# EAGLE design Pop-Up 1.0 (EAGLE 7.2.0)
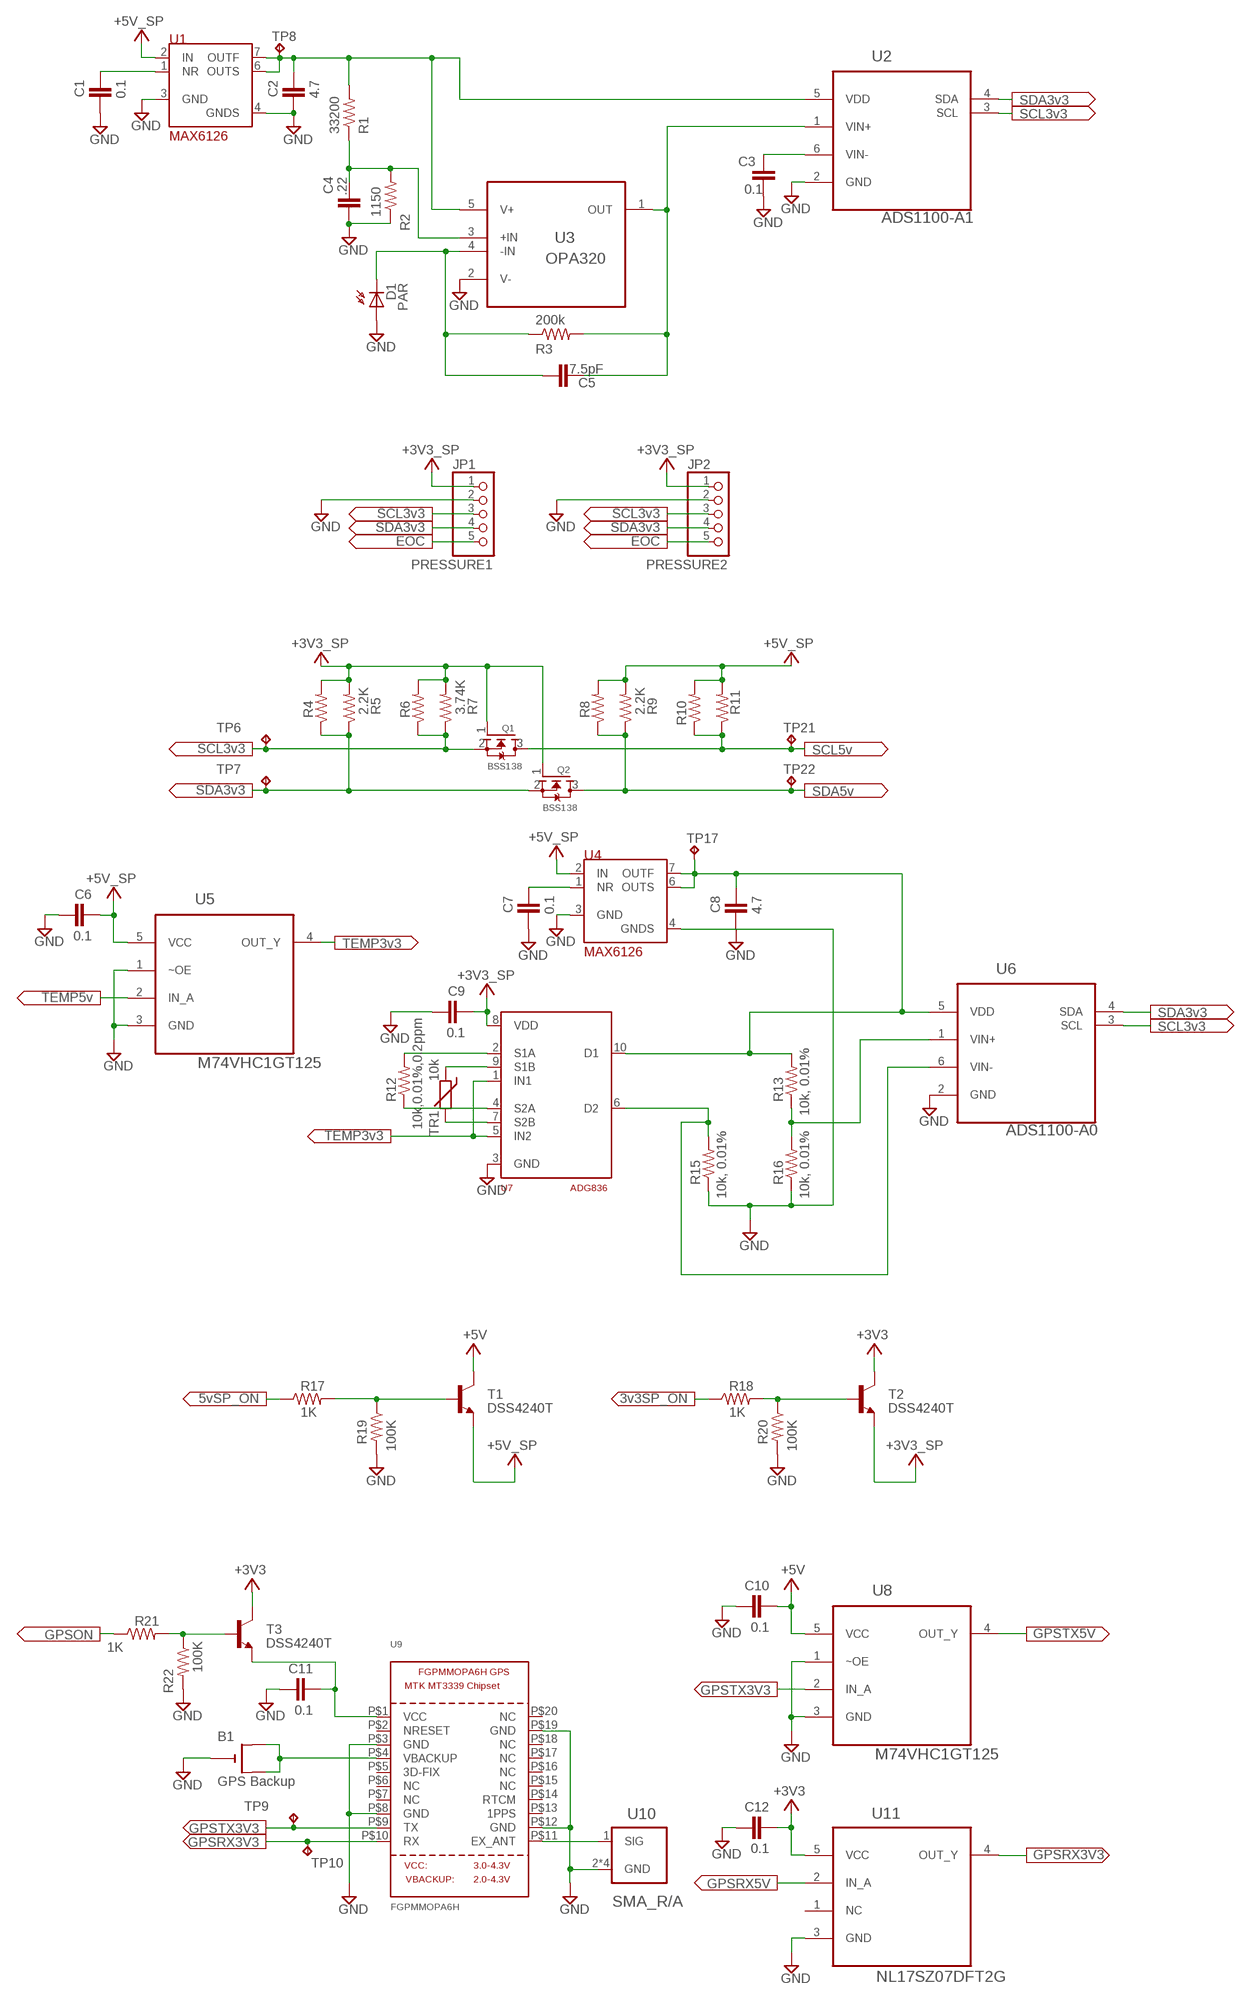
[diagram p0: schematic, sheet 1, part 1 of 2]
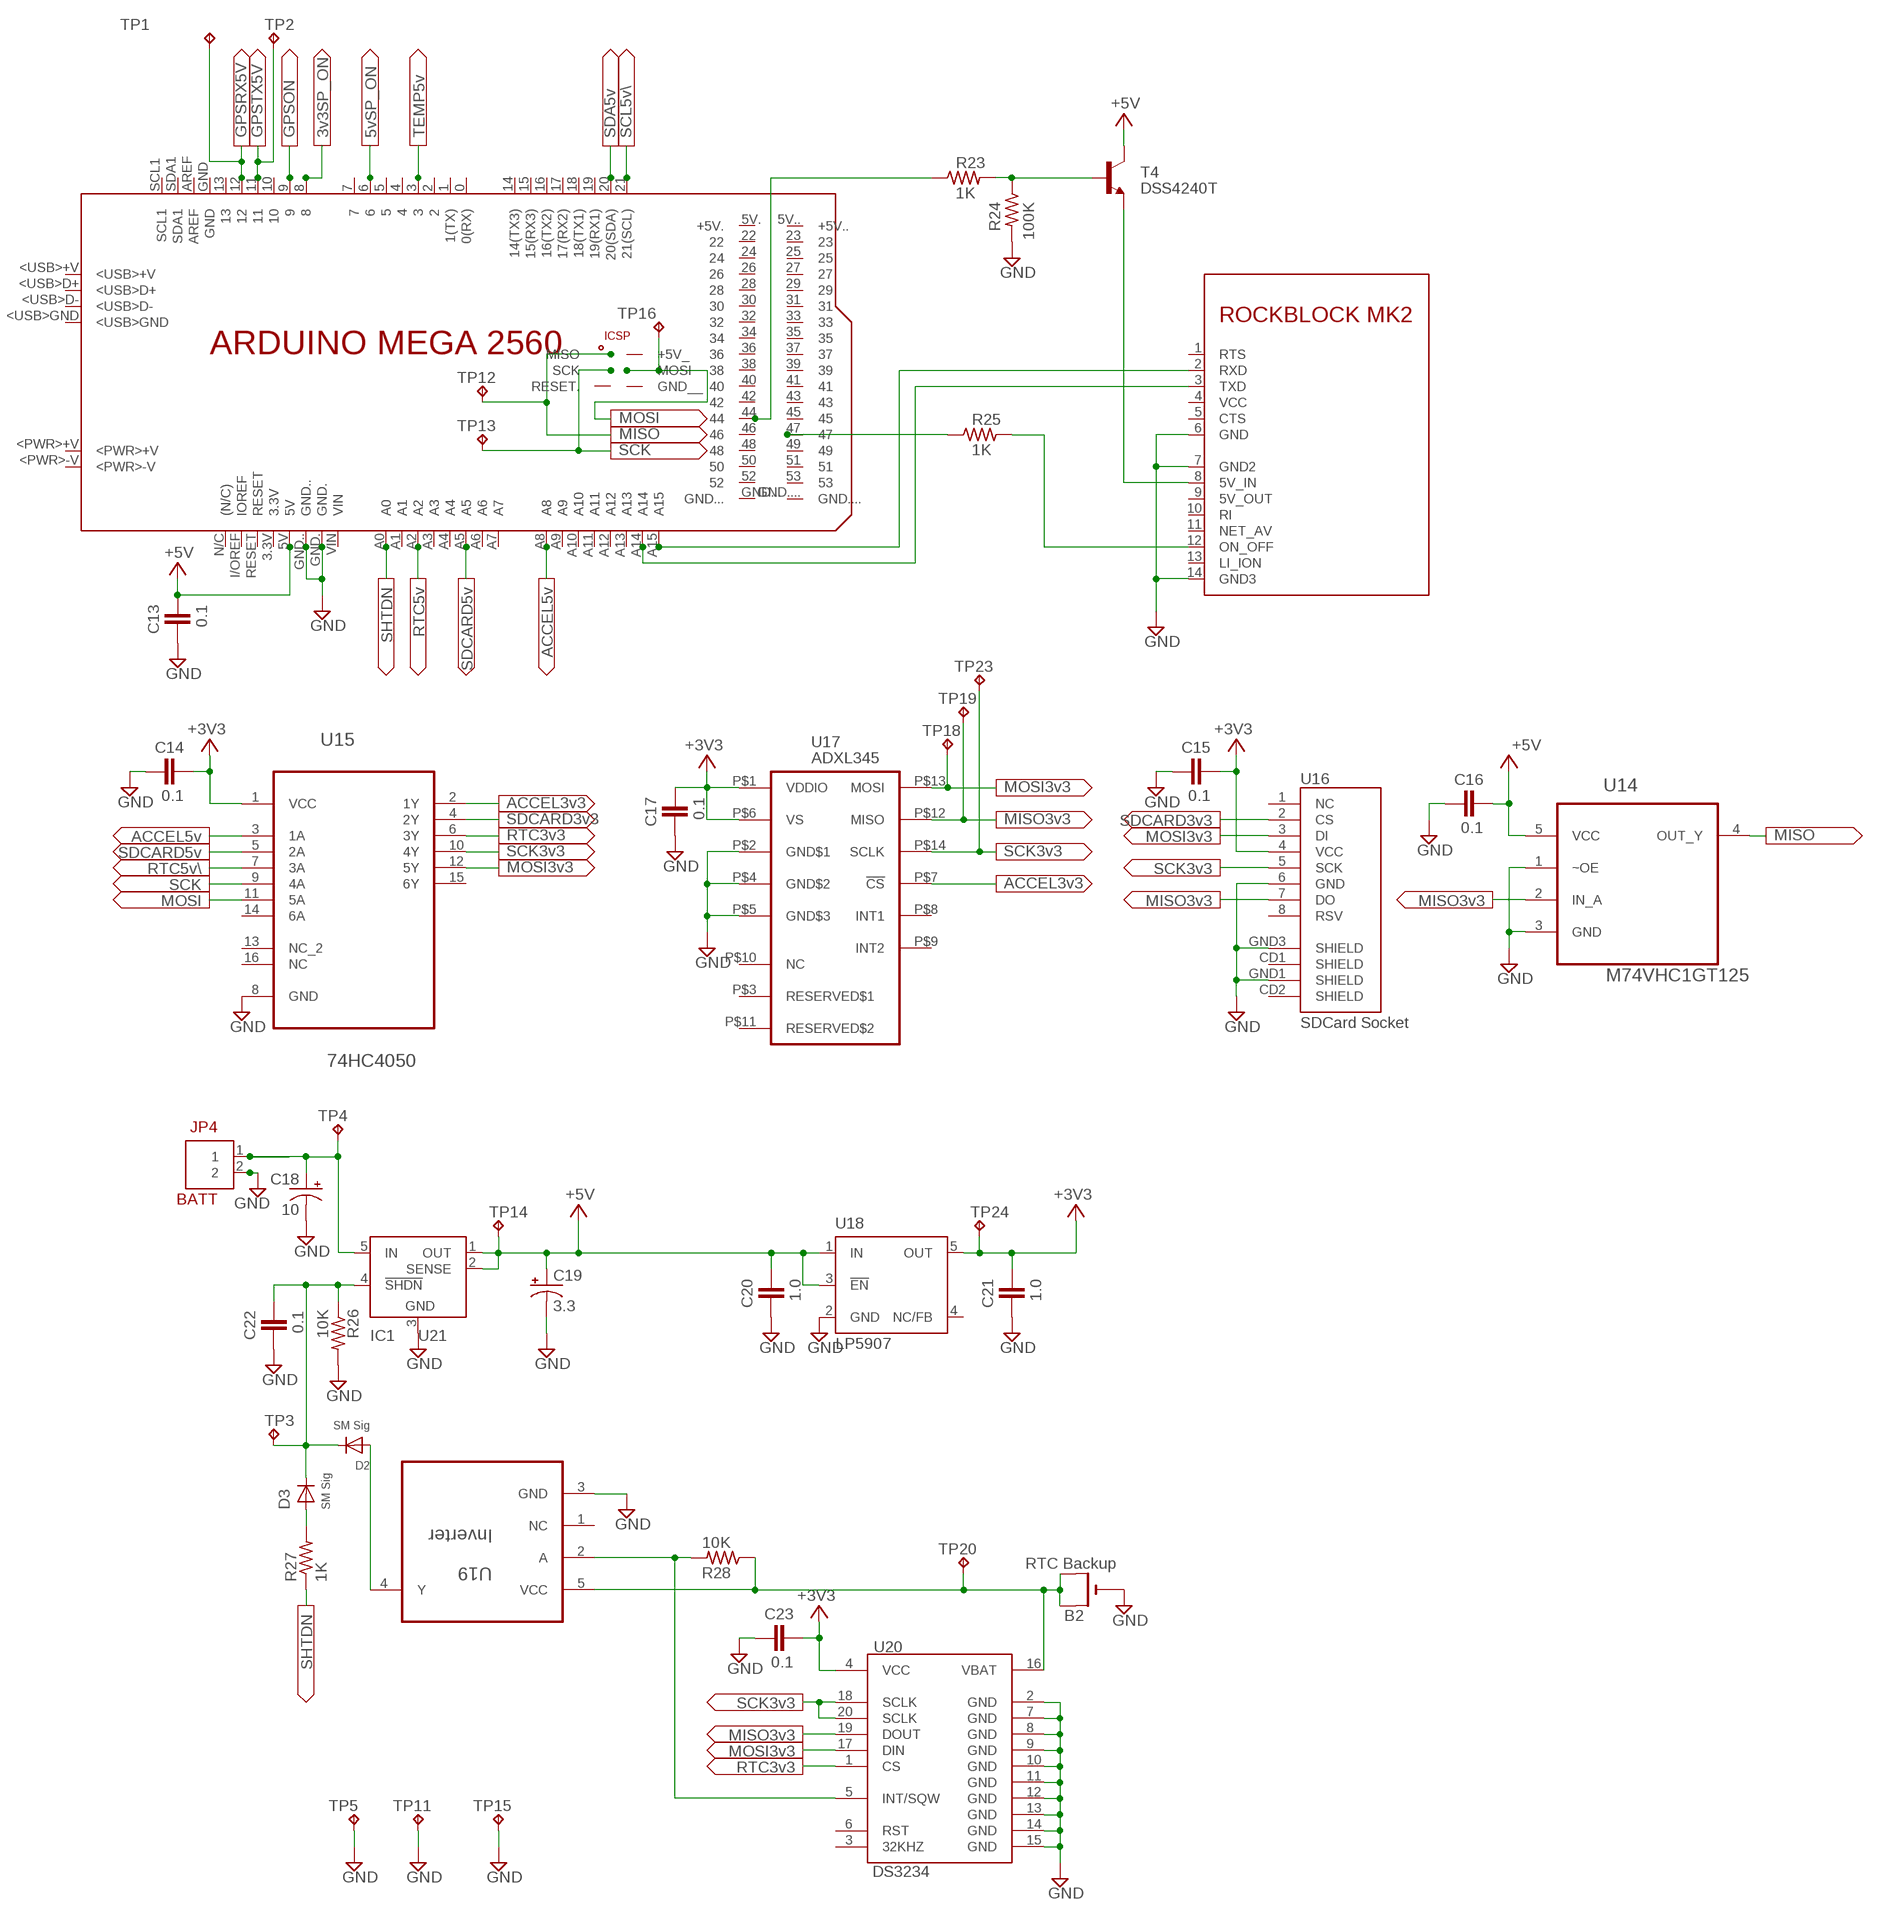
[diagram p1: schematic, sheet 1, part 2 of 2]

## Parts
B1  GPS Backup  CR1220SMT  [CR1220-SMD]
B2  RTC Backup  CR1220SMT  [CR1220-SMD]
C1  0.1  CAP0603-CAP  [0603-CAP]
C2  4.7  CAP0603-CAP  [0603-CAP]
C3  0.1  CAP0603-CAP  [0603-CAP]
C4  .22  CAP0603-CAP  [0603-CAP]
C5  7.5pF  CAP0603-CAP  [0603-CAP]
C6  0.1  CAP0603-CAP  [0603-CAP]
C7  0.1  CAP0603-CAP  [0603-CAP]
C8  4.7  CAP0603-CAP  [0603-CAP]
C9  0.1  CAP0603-CAP  [0603-CAP]
C10  0.1  CAP0603-CAP  [0603-CAP]
C11  0.1  CAP0603-CAP  [0603-CAP]
C12  0.1  CAP0603-CAP  [0603-CAP]
C13  0.1  CAP0603-CAP  [0603-CAP]
C14  0.1  CAP0603-CAP  [0603-CAP]
C15  0.1  CAP0603-CAP  [0603-CAP]
C16  0.1  CAP0603-CAP  [0603-CAP]
C17  0.1  CAP0603-CAP  [0603-CAP]
C18  10  CPOL-USA/3216-18R  [A/3216-18R]
C19  3.3  CPOL-USA/3216-18R  [A/3216-18R]
C20  1.0  CAP0603-CAP  [0603-CAP]
C21  1.0  CAP0603-CAP  [0603-CAP]
C22  0.1  CAP0603-CAP  [0603-CAP]
C23  0.1  CAP0603-CAP  [0603-CAP]
D1  PAR  SFH225  [SFH225]
D2  SM Sig  DIODESOD-323F  [SOD-323F]
D3  SM Sig  DIODESOD-323F  [SOD-323F]
IC1  U21  LT1129CQ-5  [Q5-DD]
JP1  PRESSURE1  PINHD-1X5  [1X05]
JP2  PRESSURE2  PINHD-1X5  [1X05]
JP4  BATT  KK-156-2  [KK-156-2]
Q1  BSS138  MOSFET-NREFLOW  [SOT23]
Q2  BSS138  MOSFET-NREFLOW  [SOT23]
R1  33200  R-US_R0603  [R0603]
R2  1150  R-US_R0603  [R0603]
R3  200k  R-US_R0603  [R0603]
R4  R-US_0204/2V  [0204V]
R5  2.2K  R-US_R0603  [R0603]
R6  R-US_0204/2V  [0204V]
R7  3.74K  R-US_R0603  [R0603]
R8  R-US_0204/2V  [0204V]
R9  2.2K  R-US_R0603  [R0603]
R10  R-US_0204/2V  [0204V]
R11  R-US_R0603  [R0603]
R12  10k,0.01%,0.2ppm  R-US_R1206  [R1206]
R13  10k, 0.01%  R-US_R0603  [R0603]
R15  10k, 0.01%  R-US_R0603  [R0603]
R16  10k, 0.01%  R-US_R0603  [R0603]
R17  1K  R-US_R0603  [R0603]
R18  1K  R-US_R0603  [R0603]
R19  100K  R-US_R0603  [R0603]
R20  100K  R-US_R0603  [R0603]
R21  1K  R-US_R0603  [R0603]
R22  100K  R-US_R0603  [R0603]
R23  1K  R-US_R0603  [R0603]
R24  100K  R-US_R0603  [R0603]
R25  1K  R-US_R0603  [R0603]
R26  10K  R-US_R0603  [R0603]
R27  1K  R-US_R0603  [R0603]
R28  10K  R-US_R0603  [R0603]
SUPPLY1  SDA3v3  V-->  (no package)
SUPPLY3  SCL3v3  V-->  (no package)
SUPPLY12  SCL3v3  V-->  (no package)
SUPPLY14  SCL3v3  V-->  (no package)
SUPPLY15  SDA3v3  V-->  (no package)
SUPPLY16  SDA3v3  V-->  (no package)
SUPPLY17  EOC  V-->  (no package)
SUPPLY18  EOC  V-->  (no package)
SUPPLY19  SCL3v3  V-->  (no package)
SUPPLY20  SCL5v  V-->  (no package)
SUPPLY21  SDA3v3  V-->  (no package)
SUPPLY22  SDA5v  V-->  (no package)
SUPPLY25  TEMP3v3  V-->  (no package)
SUPPLY28  TEMP5v  V-->  (no package)
SUPPLY29  SDA3v3  V-->  (no package)
SUPPLY31  SCL3v3  V-->  (no package)
SUPPLY34  TEMP3v3  V-->  (no package)
SUPPLY37  5vSP_ON  V-->  (no package)
SUPPLY38  3v3SP_ON  V-->  (no package)
SUPPLY42  GPSON  V-->  (no package)
SUPPLY43  GPSTX5V  V-->  (no package)
SUPPLY44  GPSTX3V3  V-->  (no package)
SUPPLY49  GPSTX3V3  V-->  (no package)
SUPPLY50  GPSRX3V3  V-->  (no package)
SUPPLY52  GPSRX3V3  V-->  (no package)
SUPPLY53  GPSRX5V  V-->  (no package)
SUPPLY57  GPSRX5V  V-->  (no package)
SUPPLY58  GPSTX5V  V-->  (no package)
SUPPLY59  GPSON  V-->  (no package)
SUPPLY60  3v3SP_ON  V-->  (no package)
SUPPLY61  5vSP_ON  V-->  (no package)
SUPPLY62  TEMP5v  V-->  (no package)
SUPPLY63  SDA5v  V-->  (no package)
SUPPLY64  SCL5v\  V-->  (no package)
SUPPLY66  MOSI  V-->  (no package)
SUPPLY67  MISO  V-->  (no package)
SUPPLY68  SCK  V-->  (no package)
SUPPLY69  SHTDN  V-->  (no package)
SUPPLY70  RTC5v  V-->  (no package)
SUPPLY71  SDCARD5v  V-->  (no package)
SUPPLY72  ACCEL5v  V-->  (no package)
SUPPLY77  MOSI3v3  V-->  (no package)
SUPPLY79  ACCEL3v3  V-->  (no package)
SUPPLY80  SDCARD3v3  V-->  (no package)
SUPPLY81  MISO3v3  V-->  (no package)
SUPPLY82  SDCARD3v3  V-->  (no package)
SUPPLY83  ACCEL5v  V-->  (no package)
SUPPLY84  RTC3v3  V-->  (no package)
SUPPLY85  MOSI3v3  V-->  (no package)
SUPPLY87  MISO  V-->  (no package)
SUPPLY88  SDCARD5v  V-->  (no package)
SUPPLY89  SCK3v3  V-->  (no package)
SUPPLY91  SCK3v3  V-->  (no package)
SUPPLY92  RTC5v\  V-->  (no package)
SUPPLY93  MOSI3v3  V-->  (no package)
SUPPLY94  SCK3v3  V-->  (no package)
SUPPLY95  SCK  V-->  (no package)
SUPPLY96  ACCEL3v3  V-->  (no package)
SUPPLY97  MOSI  V-->  (no package)
SUPPLY98  MISO3v3  V-->  (no package)
SUPPLY99  MISO3v3  V-->  (no package)
SUPPLY114  SHTDN  V-->  (no package)
SUPPLY117  SCK3v3  V-->  (no package)
SUPPLY118  MISO3v3  V-->  (no package)
SUPPLY119  MOSI3v3  V-->  (no package)
SUPPLY120  RTC3v3  V-->  (no package)
T1  DSS4240T  BC847  [SOT23]
T2  DSS4240T  BC847  [SOT23]
T3  DSS4240T  BC847  [SOT23]
T4  DSS4240T  BC847  [SOT23]
TP1  TP-063  [TP-063]
TP2  TP-063  [TP-063]
TP3  TP-063  [TP-063]
TP4  TP-063  [TP-063]
TP5  TP-063  [TP-063]
TP6  TP-063  [TP-063]
TP7  TP-063  [TP-063]
TP8  TP-063  [TP-063]
TP9  TP-063  [TP-063]
TP10  TP-063  [TP-063]
TP11  TP-063  [TP-063]
TP12  TP-063  [TP-063]
TP13  TP-063  [TP-063]
TP14  TP-063  [TP-063]
TP15  TP-063  [TP-063]
TP16  TP-063  [TP-063]
TP17  TP-063  [TP-063]
TP18  TP-063  [TP-063]
TP19  TP-063  [TP-063]
TP20  TP-063  [TP-063]
TP21  TP-063  [TP-063]
TP22  TP-063  [TP-063]
TP23  TP-063  [TP-063]
TP24  TP-063  [TP-063]
TR1  10k  THERMISTOR-2,5  [RS-2,5]
U1  MAX6126  [SOIC127P600X175-8N]
U2  ADS1100-A1  ADS1100A0IDBVT  [SOT95P280X145-6N]
U3  OPA320  OPA320AIDBVT  [SOT95P280X145-5N]
U4  MAX6126  [SOIC127P600X175-8N]
U5  M74VHC1GT125  M74VHC1GT125DF1G  [SOT65P210X110-5N]
U6  ADS1100-A0  ADS1100A0IDBVT  [SOT95P280X145-6N]
U7  ADG836  [MSOP10]
U8  M74VHC1GT125  M74VHC1GT125DF1G  [SOT65P210X110-5N]
U9  FGPMMOPA6H  GPS_FGPMMOPA6H  [FGPMMOPA6H]
U10  SMA_R/A  901-143  [AMPHENOL_901-143]
U11  NL17SZ07DFT2G  [SOT65P210X110-5N]
U12  MEGA2650_UPSIDEDOWNMOUNT  [MEGA2650_UPSIDEDOWNMOUNT]
U13  ROCKBLOCK_MK2_UPSIDEDOWN  [ROCKBLOCK_MK2_UPSIDEDOWN]
U14  M74VHC1GT125  M74VHC1GT125DF1G  [SOT65P210X110-5N]
U15  74HC4050  M74HC4050RM13TR  [SOIC127P600X175-16N]
U16  SDCard Socket  USD-SOCKETNEW  [MICRO-SD-SOCKET-PP]
U17  ADXL345  [LGA14]
U18  LP5907  TPS77033  [SOT23-DBV]
U19  Inverter  1P1G14MDBVREPG4  [SOT95P280X145-5N]
U20  DS3234  [DS3234]

## Nets
3V3SP_ON: R18.1 SUPPLY38.P$1 SUPPLY60.P$1 U12.8
5VSP_ON: R17.1 SUPPLY37.P$1 SUPPLY61.P$1 U12.6
+3V3: C12.1 C14.1 C15.1 C17.1 C21.1 C23.1 T2.3(C) T3.3(C) TP24.1 U11.5(VCC) U15.1(VCC) U16.4(VCC) U17.P$1(VDDIO) U17.P$6(VS) U18.5(OUT) U20.4(VCC)
+3V3SP: C9.1 JP1.1 JP2.1 Q1.1(G) Q2.1(G) R4.2 R5.2 R6.2 R7.2 T2.2(E) U7.8(VDD) ; supply symbol labelled +3V3_SP
+5V: C10.1 C13.1 C16.1 C19.+ C20.1 IC1.1(OUT) IC1.2(SENSE) T1.3(C) T4.3(C) TP14.1 U8.5(VCC) U12.5V U14.5(VCC) U18.1(IN) U18.3(!EN)
+5V_SP: C6.1 R8.2 R9.2 R10.2 R11.2 T1.2(E) U1.2(IN) U4.2(IN) U5.5(VCC)
ACCEL3V3: SUPPLY79.P$1 SUPPLY96.P$1 U15.2(1Y) U17.P$7(!CS)
ACCEL5V: SUPPLY72.P$1 SUPPLY83.P$1 U12.A8 U15.3(1A)
EOC1: JP1.5 SUPPLY17.P$1
EOC2: JP2.5 SUPPLY18.P$1
GND: B1.- B2.- C1.2 C2.2 C3.1 C4.2 C6.2 C7.2 C8.2 C9.2 C10.2 C11.2 C12.2 C13.2 C14.2 C15.2 C16.2 C17.2 C18.- C19.- C20.2 C21.2 C22.2 C23.2 D1.A IC1.3(GND) JP1.2 JP2.2 JP4.2 R2.1 R15.1 R16.1 R19.2 R20.2 R22.2 R24.2 R26.2 TP5.1 TP11.1 TP15.1 U1.3(GND) U1.4(GNDS) U2.2(GND) U3.2(V-) U4.3(GND) U4.4(GNDS) U5.1(~OE) U5.3(GND) U6.2(GND) U7.3(GND) U8.1(~OE) U8.3(GND) U9.P$3(GND) U9.P$8(GND) U9.P$12(GND) U9.P$19(GND) U10.2(GND) U10.3(GND) U10.4(GND) U10.5(GND) U11.3(GND) U12.GND. U12.GND.. U13.6(GND) U13.7(GND2) U13.14(GND3) U14.1(~OE) U14.3(GND) U15.8(GND) U16.6(GND) U16.GND1(SHIELD) U16.GND3(SHIELD) U17.P$2(GND$1) U17.P$4(GND$2) U17.P$5(GND$3) U18.2(GND) U19.3(GND) U20.2(GND) U20.7(GND) U20.8(GND) U20.9(GND) U20.10(GND) U20.11(GND) U20.12(GND) U20.13(GND) U20.14(GND) U20.15(GND)
GPSON: R21.1 SUPPLY42.P$1 SUPPLY59.P$1 U12.9
GPSRX3V3: SUPPLY50.P$1 SUPPLY52.P$1 TP10.1 U9.P$10(RX) U11.4(OUT_Y)
GPSRX5V: SUPPLY53.P$1 SUPPLY57.P$1 TP1.1 U11.2(IN_A) U12.12
GPSTX3V3: SUPPLY44.P$1 SUPPLY49.P$1 TP9.1 U8.2(IN_A) U9.P$9(TX)
GPSTX5V: SUPPLY43.P$1 SUPPLY58.P$1 TP2.1 U8.4(OUT_Y) U12.11
MISO: SUPPLY67.P$1 SUPPLY87.P$1 TP12.1 U12.MISO U14.4(OUT_Y)
MISO3V3: SUPPLY81.P$1 SUPPLY98.P$1 SUPPLY99.P$1 SUPPLY118.P$1 TP19.1 U14.2(IN_A) U16.7(DO) U17.P$12(MISO) U20.19(DOUT)
MOSI: SUPPLY66.P$1 SUPPLY97.P$1 TP16.1 U12.MOSI U15.11(5A)
MOSI3V3: SUPPLY77.P$1 SUPPLY85.P$1 SUPPLY93.P$1 SUPPLY119.P$1 TP18.1 U15.12(5Y) U16.3(DI) U17.P$13(MOSI) U20.17(DIN)
N$1: D2.A U19.4(Y)
N$2: R23.2 R24.1 T4.1(B)
N$3: B2.+$1(+) B2.+$2(+1) R28.1 TP20.1 U19.5(VCC) U20.16(VBAT)
N$4: R25.2 U13.12(ON_OFF)
N$5: C7.1 U4.1(NR)
N$6: R25.1 U12.47
N$7: TR1.1 U7.9(S1B)
N$8: R23.1 U12.44
N$9: T4.2(E) U13.8(5V_IN)
N$10: U9.P$11(EX_ANT) U10.1(SIG)
N$11: C8.1 R13.2 TP17.1 U4.6(OUTS) U4.7(OUTF) U6.5(VDD) U7.10(D1)
N$12: R15.2 U6.6(VIN-) U7.6(D2)
N$13: TR1.2 U7.7(S2B)
N$14: B1.+$1(+) B1.+$2(+1) U9.P$4(VBACKUP)
N$15: R21.2 R22.1 T3.1(B)
N$16: R13.1 R16.2 U6.1(VIN+)
N$17: R28.2 U19.2(A) U20.5(INT/SQW)
N$18: U12.A14 U13.3(TXD)
N$19: C11.1 T3.2(E) U9.P$1(VCC)
N$20: U12.A15 U13.2(RXD)
N$21: R12.1 U7.4(S2A)
N$22: R12.2 U7.2(S1A)
N$23: C2.1 R1.2 TP8.1 U1.6(OUTS) U1.7(OUTF) U2.5(VDD) U3.5(V+)
N$24: C1.1 U1.1(NR)
N$25: C5.2 R3.2 U2.1(VIN+) U3.1(OUT)
N$26: C3.2 U2.6(VIN-)
N$28: C4.1 R1.1 R2.2 U3.3(+IN)
N$30: C5.1 D1.K(C) R3.1 U3.4(-IN)
N$31: C22.1 D2.C D3.C IC1.4(!SHDN) R26.1 TP3.1
N$32: R17.2 R19.1 T1.1(B)
N$33: R18.2 R20.1 T2.1(B)
N$44: D3.A R27.2
RTC3V3: SUPPLY84.P$1 SUPPLY120.P$1 U15.6(3Y) U20.1(CS)
RTC5V: SUPPLY70.P$1 SUPPLY92.P$1 U12.A2 U15.7(3A)
SCK: SUPPLY68.P$1 SUPPLY95.P$1 TP13.1 U12.SCK U15.9(4A)
SCK3V3: SUPPLY89.P$1 SUPPLY91.P$1 SUPPLY94.P$1 SUPPLY117.P$1 TP23.1 U15.10(4Y) U16.5(SCK) U17.P$14(SCLK) U20.18(SCLK) U20.20(SCLK)
SCL3V3: JP1.3 JP2.3 Q1.2(S) R6.1 R7.1 SUPPLY3.P$1 SUPPLY12.P$1 SUPPLY14.P$1 SUPPLY19.P$1 SUPPLY31.P$1 TP6.1 U2.3(SCL) U6.3(SCL)
SCL5V: Q1.3(D) R10.1 R11.1 SUPPLY20.P$1 SUPPLY64.P$1 TP21.1 U12.21(21(SCL))
SDA3V3: JP1.4 JP2.4 Q2.2(S) R4.1 R5.1 SUPPLY1.P$1 SUPPLY15.P$1 SUPPLY16.P$1 SUPPLY21.P$1 SUPPLY29.P$1 TP7.1 U2.4(SDA) U6.4(SDA)
SDA5V: Q2.3(D) R8.1 R9.1 SUPPLY22.P$1 SUPPLY63.P$1 TP22.1 U12.20(20(SDA))
SDCARD3V3: SUPPLY80.P$1 SUPPLY82.P$1 U15.4(2Y) U16.2(CS)
SDCARD5V: SUPPLY71.P$1 SUPPLY88.P$1 U12.A5 U15.5(2A)
SHTDN: R27.1 SUPPLY69.P$1 SUPPLY114.P$1 U12.A0
TEMP3V3: SUPPLY25.P$1 SUPPLY34.P$1 U5.4(OUT_Y) U7.1(IN1) U7.5(IN2)
TEMP5V: SUPPLY28.P$1 SUPPLY62.P$1 U5.2(IN_A) U12.3
VBATT: C18.+ IC1.5(IN) JP4.1 TP4.1
Unconnected: U9.P$2(NRESET) U9.P$5(3D-FIX) U9.P$6(NC) U9.P$7(NC) U9.P$13(1PPS) U9.P$14(RTCM) U9.P$15(NC) U9.P$16(NC) U9.P$17(NC) U9.P$18(NC) U9.P$20(NC) U11.1(NC) U12.0(0(RX)) U12.1(1(TX)) U12.2 U12.3.3V U12.4 U12.5 U12.5V.(+5V.) U12.5V..(+5V..) U12.7 U12.10 U12.13 U12.14(14(TX3)) U12.15(15(RX3)) U12.16(16(TX2)) U12.17(17(RX2)) U12.18(18(TX1)) U12.19(19(RX1)) U12.22 U12.23 U12.24 U12.25 U12.26 U12.27 U12.28 U12.29 U12.30 U12.31 U12.32 U12.33 U12.34 U12.35 U12.36 U12.37 U12.38 U12.39 U12.40 U12.41 U12.42 U12.43 U12.45 U12.46 U12.48 U12.49 U12.50 U12.51 U12.52 U12.53 U12.+5V_ U12.<PWR>+V U12.<PWR>-V U12.<USB>+V U12.<USB>D+ U12.<USB>D- U12.<USB>GND U12.A1 U12.A3 U12.A4 U12.A6 U12.A7 U12.A9 U12.A10 U12.A11 U12.A12 U12.A13 U12.AREF U12.GND U12.GND... U12.GND.... U12.GND__ U12.I/OREF(IOREF) U12.N/C((N/C)) U12.RESET U12.RESET. U12.SCL1 U12.SDA1 U12.VIN U13.1(RTS) U13.4(VCC) U13.5(CTS) U13.9(5V_OUT) U13.10(RI) U13.11(NET_AV) U13.13(LI_ION) U15.13(NC_2) U15.14(6A) U15.15(6Y) U15.16(NC) U16.1(NC) U16.8(RSV) U16.CD1(SHIELD) U16.CD2(SHIELD) U17.P$3(RESERVED$1) U17.P$8(INT1) U17.P$9(INT2) U17.P$10(NC) U17.P$11(RESERVED$2) U18.4(NC/FB) U19.1(NC) U20.3(32KHZ) U20.6(RST)

## Library data of the parts
B1 B2 = adafruit:CR1220: CR1216/CR1220/CR1225 12mm 3V lithium coin cell Great for battery packup. Both SMT and THM holders. Note the THM package has the ground pads on both sides of the PCB so that the masks are the same - this reduces the cost
C1-C17 C20-C23 = SparkFun-Capacitors:CAP: Capacitor Standard 0603 ceramic capacitor, and 0.1" leaded capacitor.; MPN: 2222 370 21104; OC_NEWARK: 98K6987
C18 C19 = rcl:CPOL-US: POLARIZED CAPACITOR, American symbol
D1 = opto-trans-siemens:SFH225: PHOTO DIODE; OC_FARNELL: unknown; OC_NEWARK: unknown
D2 D3 = adafruit:DIODE: Diode SMADIODE - SMA Surface Mount Package 20V 1A Schottky Diode Digikey: 641-1014-6-ND DO-1N4148 - Through Hole Small Current Diode SOD-123 20V 1 A (.5mV Vf) Schottky Diode - Digikey: MBRX120TPMSCT-ND SOD-323 10V 570mA (.38mV Vf, 3ns) Schottky Diode - Digikey: ZLLS410CT-ND SOD-523 30V 30mA Schottky Diode (RB751S-40TE61) - Digikey: RB751S-40TE61CT-ND SOT23-R/W - SOT23 Package (R = Solder Paste/Reflow Ovens, W = Hand-Soldering) BAT54Film 40V 300mA - Digikey: 497-7162-1-ND; OC_NEWARK: unknown
IC1 = linear-technology:LT1129CQ-5: VOLTAGE REGULATOR with shutdown; MPN: LT1129CQ-5#PBF; OC_FARNELL: 1663373; OC_NEWARK: 57M2058
JP1 JP2 = pinhead:PINHD-1X5: PIN HEADER
JP4 = con-molex:KK-156-2: KK 156 HEADER Source: http://www.molex.com/pdm_docs/sd/026604100_sd.pdf; OC_FARNELL: unknown; OC_NEWARK: unknown
Q1 Q2 = adafruit:MOSFET-N: N-Channel Mosfet 2N7002E - 60V 260mA SOT23 [Digikey: 2N7002ET1GOSTR-ND] - REEL BSH103 - 30V 850mA SOT23 [Digikey: 568-5013-1-ND]
R1-R3 R5 R7 R9 R11 R17-R28 = resistor:R-US_: RESISTOR, American symbol; OC_NEWARK: unknown
R4 R6 R8 R10 R13 R15 R16 = resistor:R-US_: RESISTOR, American symbol
R12 = rcl:R-US_: RESISTOR, American symbol
SUPPLY1 SUPPLY3 SUPPLY12 SUPPLY14-SUPPLY22 SUPPLY25 SUPPLY28 SUPPLY29 SUPPLY31 SUPPLY34 SUPPLY37 SUPPLY38 SUPPLY42-SUPPLY44 SUPPLY49 SUPPLY50 SUPPLY52 SUPPLY53 SUPPLY57-SUPPLY64 SUPPLY66-SUPPLY72 SUPPLY77 SUPPLY79-SUPPLY85 SUPPLY87-SUPPLY89 SUPPLY91-SUPPLY99 SUPPLY114 SUPPLY117-SUPPLY120 = supply2:V-->: SUPPLY SYMBOL
T1-T4 = transistor-neu-to92:BC847: NPN TRANSISTOR
TP1-TP24 = keystone:TP: TEST POINT PCB Vertical Mount; OC_NEWARK: unknown
TR1 = varistor:THERMISTOR: THERMISTOR
U1 U4 = Maxim_By_element14_Batch_1:MAX6126
U2 U6 = Texas Instruments_By_element14_Batch_1:ADS1100A0IDBVT: Self-Calibrating, 16-Bit ANALOG-TO-DIGITAL CONVERTER; MPN: ADS1100A0IDBVT; OC_FARNELL: 1135959; OC_NEWARK: 20H0708; PACKAGE: SOT-23-6; SUPPLIER: Texas Instruments
U3 = Texas Instruments_By_element14_Batch_1:OPA320AIDBVT: Operational Amplifier; MPN: OPA320AIDBVT; OC_FARNELL: 2057093; OC_NEWARK: 64T3764; PACKAGE: SOT-23-5; SUPPLIER: Texas Instruments
U5 U8 U14 = ON Semiconductor_By_element14_Batch_1:M74VHC1GT125DF1G: Noninverting Buffer / CMOS Logic Level Shifter; MPN: M74VHC1GT125DF1G; OC_FARNELL: 1567363; OC_NEWARK: 83H7591; PACKAGE: SOT-23-5; SUPPLIER: ON SEMICONDUCTOR
U7 = analog-devices:ADG836
U9 = adafruit:GPS_FGPMMOPA6H: GPS Module - MTK MT3339 Chipset, -165dBm sensitivity, 22 channels, 10Hz, auto-select external antenna options
U10 = Amphenol_By_element14_Batch_1:901-143: RF/COAXIAL, SMA JACK, R/A, 50OHM, THD; MPN: 901-143; OC_FARNELL: 1461631; OC_NEWARK: 51F3841; PACKAGE: RF/COAXIAL, SMA JACK, R/A, 50OHM, THD; SUPPLIER: Amphenol
U11 = ON Semiconductor_By_element14_Batch_1:NL17SZ07DFT2G: Single Non-Inverting Buffer with Open Drain Output; MPN: NL17SZ07DFT2G; OC_FARNELL: 1705431; OC_NEWARK: 04R7799; PACKAGE: SOT-353-5; SUPPLIER: ON Semiconductor
U12 = E14_Arduino_revB:MEGA2650_UPSIDEDOWNMOUNT
U13 = E14_Arduino_revB:ROCKBLOCK_MK2_UPSIDEDOWN
U15 = ST Microelctronics_By_element14_Batch_1:M74HC4050RM13TR: HEX BUFFER/CONVERTER; MPN: M74HC4050RM13TR; OC_FARNELL: 1261257; OC_NEWARK: 89K0905; PACKAGE: SOIC-16; SUPPLIER: STMICROELECTRONICS
U16 = SparkFun-Connectors:USD-SOCKET: microSD Socket Push-push type uSD socket. Schematic element and footprint production proven. Spark Fun Electronics SKU : PRT-00127. tDoc lines correctly indicate media card edge positions when inserting (unlocked, locked, depressed).
U17 = adxl345:ADXL345: 3-Axis, ±2 g/±4 g/±8 g/±16 g Digital Accelerometer
U18 = texas:TPS770*: ULTRALOW-POWER 50-mA LOW-DROPOUT LINEAR REGULATORS 50-mA Low-Dropout Regulator Source: http://focus.ti.com/lit/ds/symlink/tps77001.pdf; MF: TEXAS INSTRUMENTS; MPN: TPS77033DBVT; OC_FARNELL: 8461570; OC_NEWARK: 77C1187
U19 = Texas Instruments_By_element14_Batch_1:1P1G14MDBVREPG4: SINGLE SCHMITT-TRIGGER INVERTER; MPN: 1P1G14MDBVREPG4; OC_FARNELL: -; OC_NEWARK: unknown; PACKAGE: SOT-23-5; SUPPLIER: Texas Instruments
U20 = SparkFun-FreqCtrl:DS3234: SPI RTC module with battery backup and internal clock.

## Board
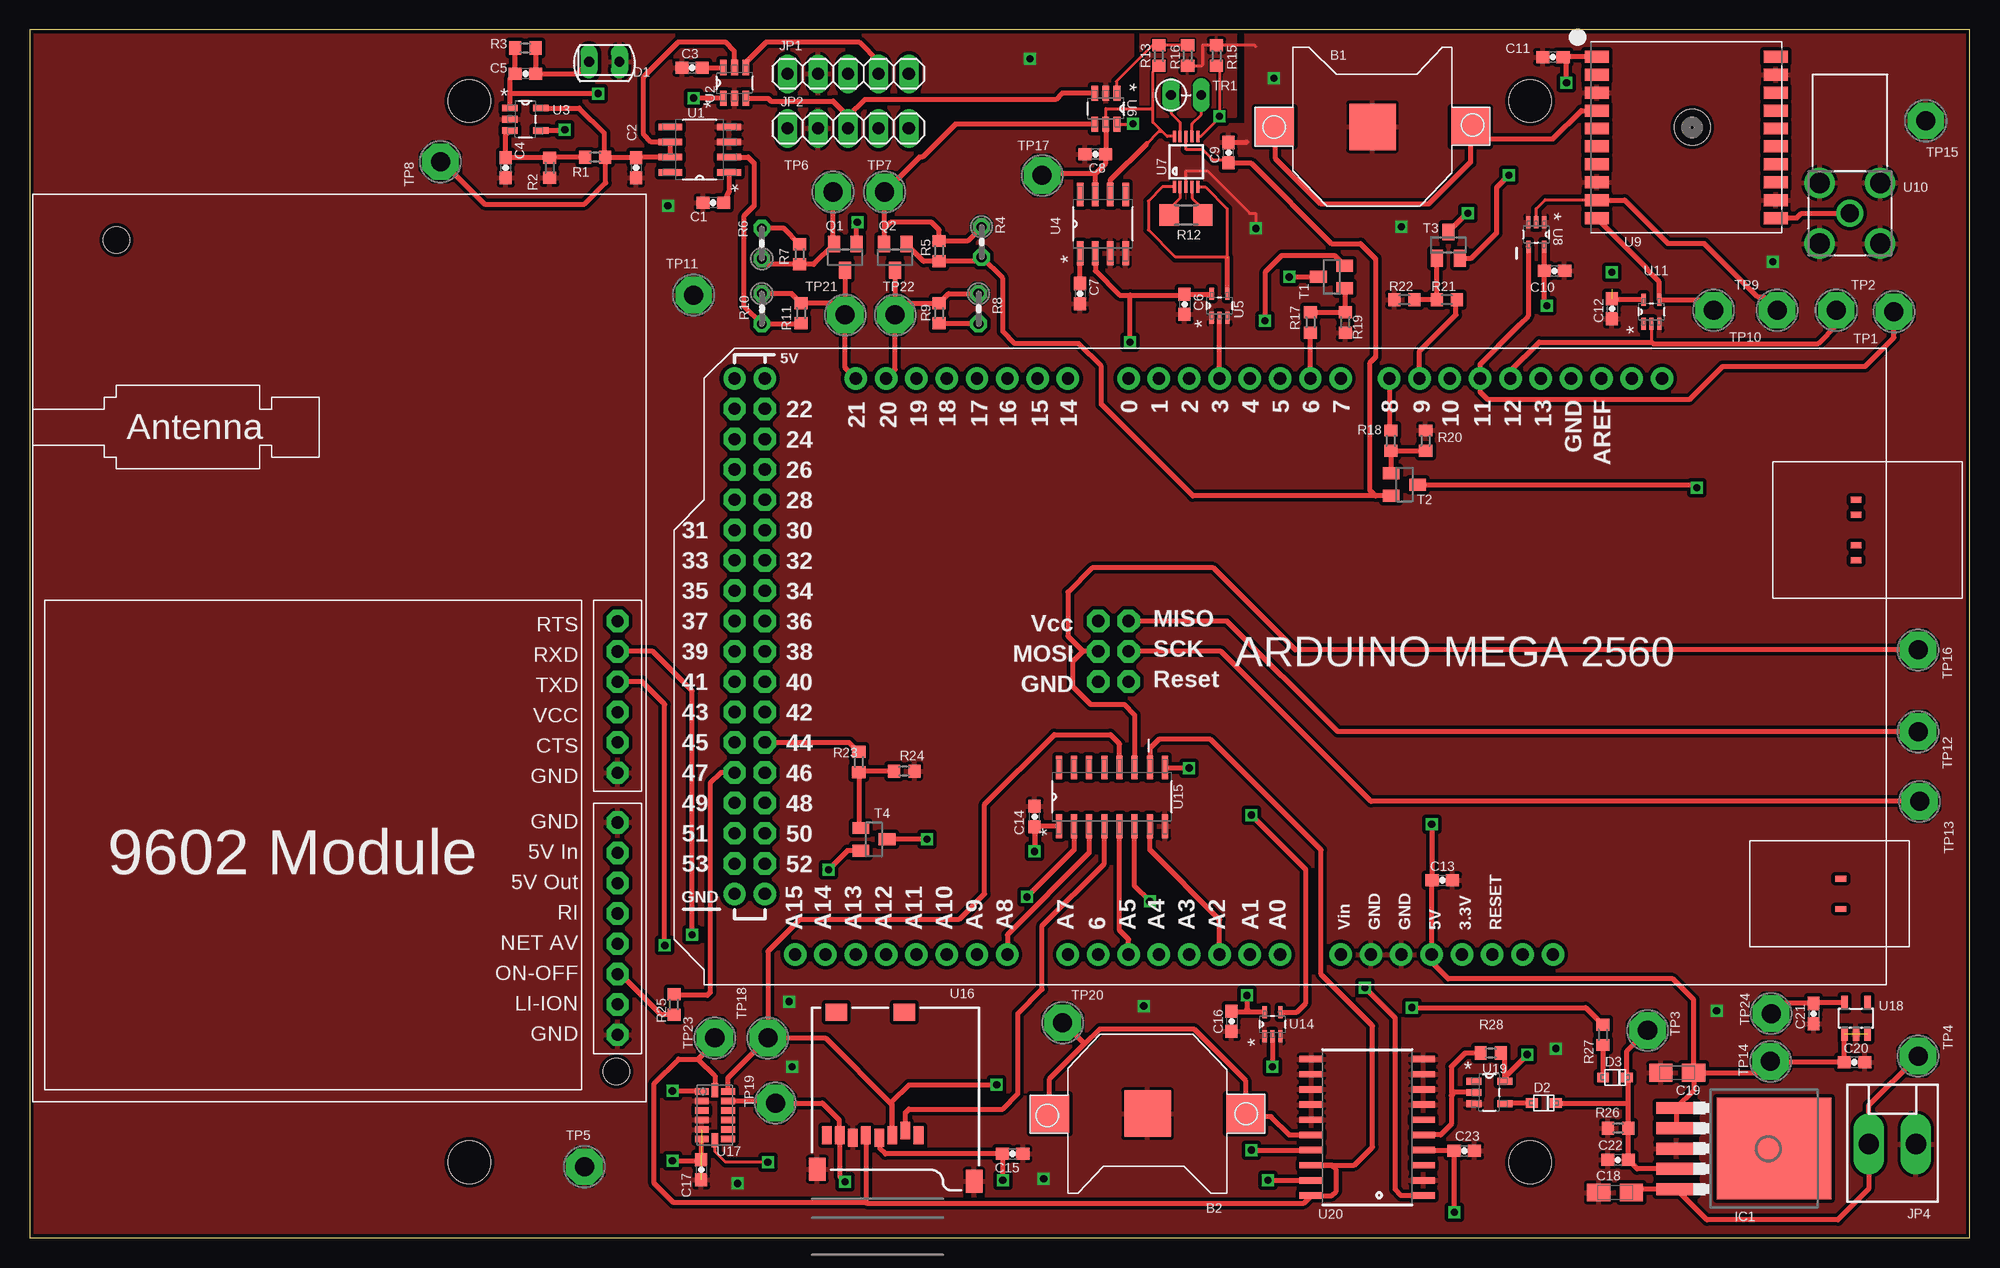
[diagram p2: board, top side]
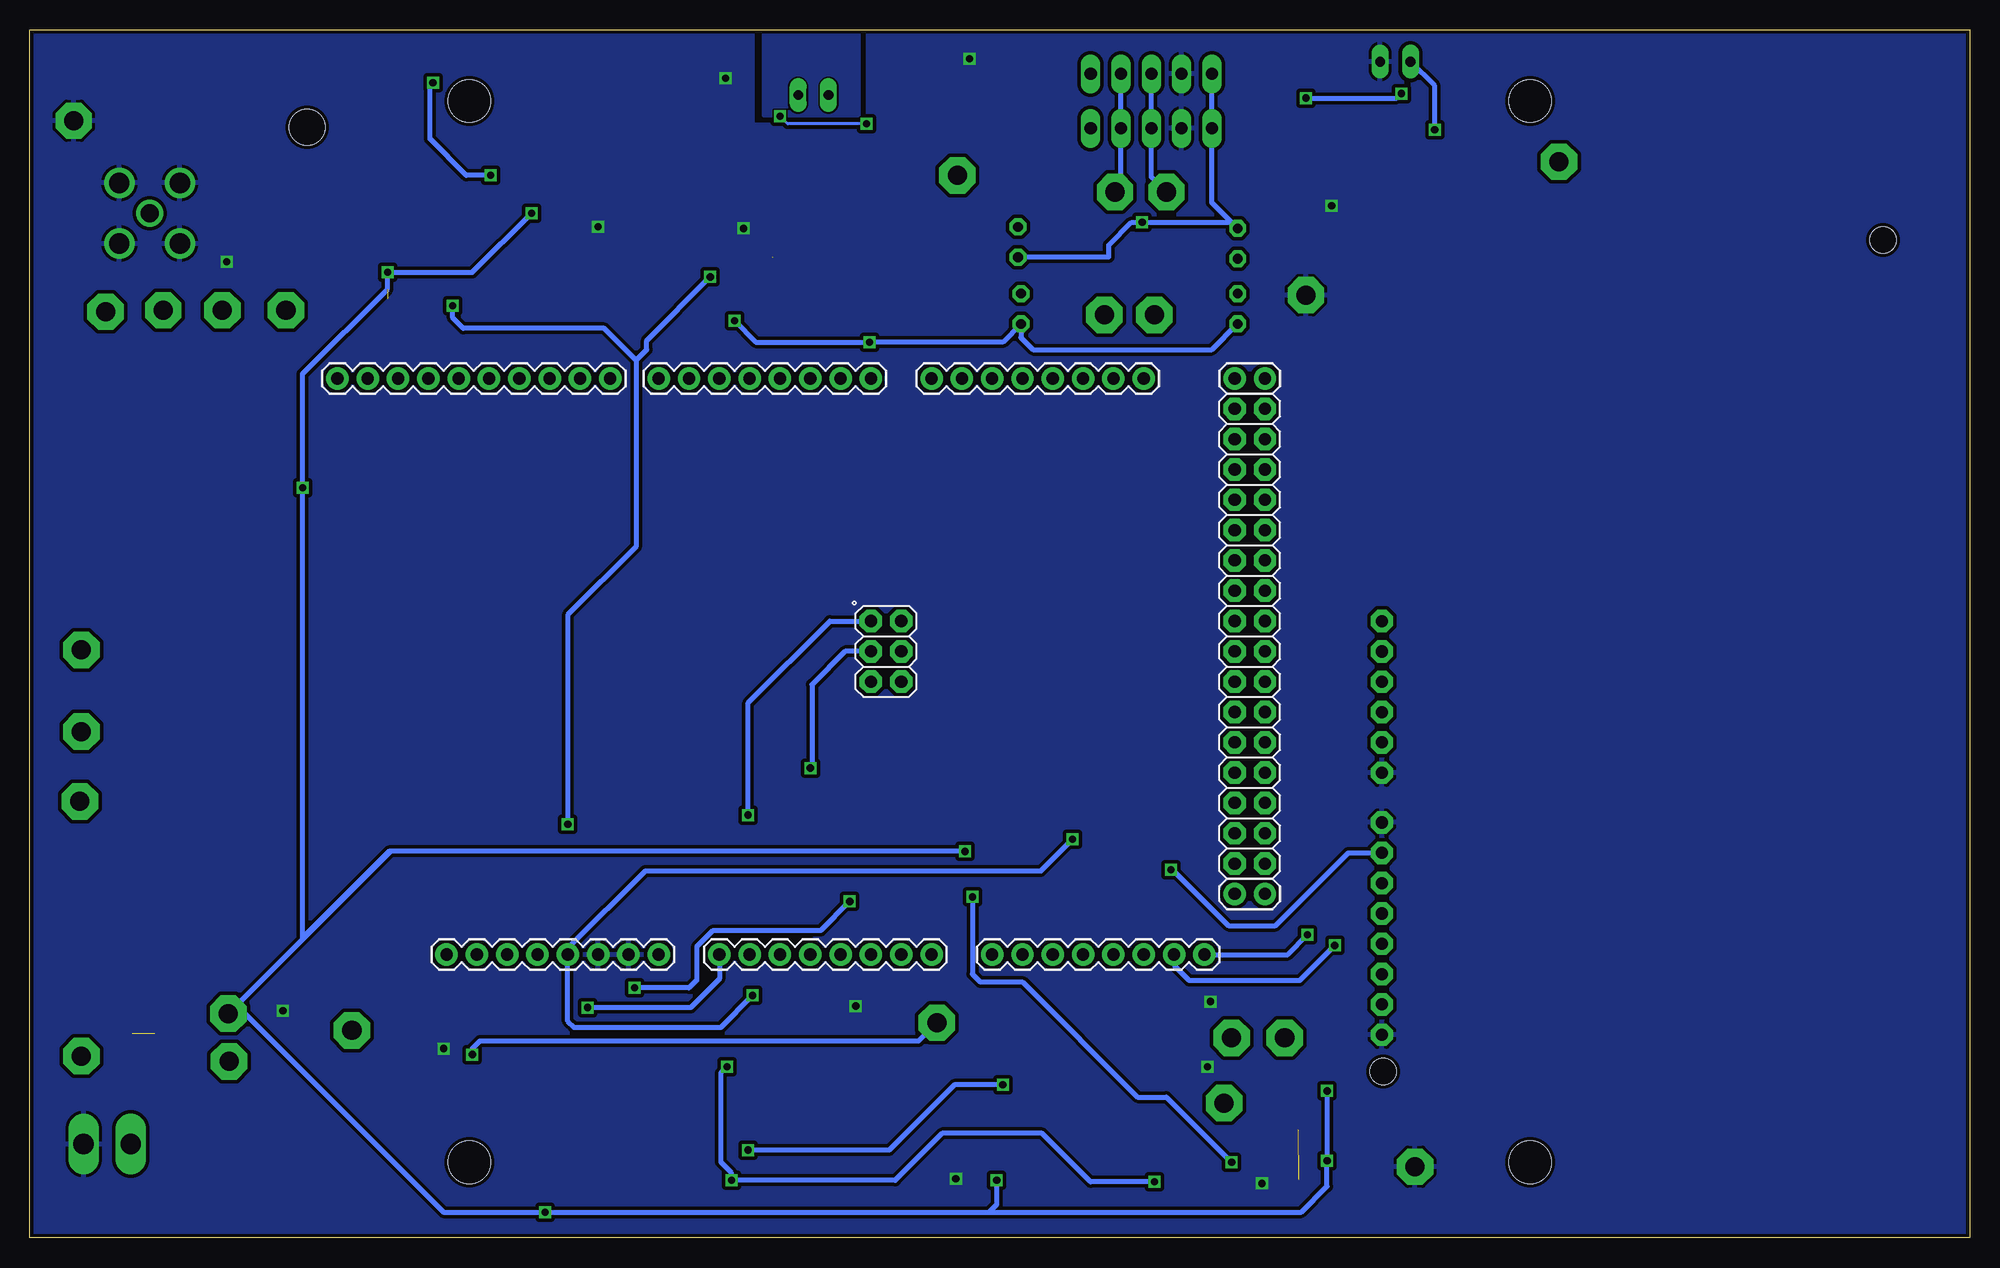
[diagram p3: board, bottom side, seen from below]

Size 162.56 x 101.22 mm. Coordinates in mm from the lower left corner, seen from the top.
Outline: 0,0 162.56,0 162.56,101.22 0,101.22 0,0
Copper layers (1*16): Top 0.035mm / dielectric 1.5mm / Bottom 0.035mm
Design rules "default *": minimum track width 10mil, minimum drill 20mil, track to track 6mil, track to pad 6mil, pad to pad 6mil, via to via 6mil, smd to smd 6mil, copper to edge 12mil, drill to drill 12mil, minimum pad ring 12mil, minimum via ring 8mil, stop-mask expansion 4mil, vias tented up to drill 0mil, thermal gap 10mil
Holes 3.56 mm at 36.83,95.25 125.73,95.25 36.83,6.35 125.73,6.35

### Footprints (pad centres in the part's own frame; a part is rotated, then mirrored left to right if it is on the bottom)
CR1220-SMD = smd 3.2 x 3.2: +$1 -8.2,0; +$2 8.2,0 | smd 3.9 x 3.9: - 0,0
0603-CAP = smd 1.1 x 1: 1 -0.85,0; 2 0.85,0
A/3216-18R = smd 1.95 x 1.5: + 1.375,0; - -1.375,0
SFH225 = drill 0.813 long: A 0,1.27; K 0,-1.27
SOD-323F = smd 1 x 0.8: A -1,0; C 1,0
Q5-DD = smd 1 x 3.4: 1 -3.4,-7.875; 2 -1.7,-7.875; 3 0,-7.875; 4 1.7,-7.875; 5 3.4,-7.875 | smd 8.5 x 9.6: 6 0,0.325
1X05 = drill 1.016 long: 1 -5.08,0; 2 -2.54,0; 3 0,0; 4 2.54,0; 5 5.08,0
KK-156-2 = drill 1.7 pad 2.184 long: 1 -1.98,0; 2 1.98,0
SOT23 = smd 1 x 1.4: 1 -0.95,-1.1; 2 0.95,-1.1; 3 0,1.1
R0603 = smd 1 x 1.1: 1 -0.85,0; 2 0.85,0
0204V = drill 0.813 octagon: 1 -1.27,0; 2 1.27,0
R1206 = smd 1.6 x 1.803: 1 -1.422,0; 2 1.422,0
TP-063 = drill 1.6 pad 3.048 octagon: 1 0,0
RS-2,5 = drill 0.813 long: 1 -1.27,0; 2 1.27,0
SOIC127P600X175-8N = smd 1.981 x 0.533: 1 -2.464,1.905; 2 -2.464,0.635; 3 -2.464,-0.635; 4 -2.464,-1.905; 5 2.464,-1.905; 6 2.464,-0.635; 7 2.464,0.635; 8 2.464,1.905
SOT95P280X145-6N = smd 1.27 x 0.559: 1 -1.295,0.94; 2 -1.295,0; 3 -1.295,-0.94; 4 1.295,-0.94; 5 1.295,0; 6 1.295,0.94
SOT95P280X145-5N = smd 1.27 x 0.559: 1 -1.295,0.94; 2 -1.295,0; 3 -1.295,-0.94; 4 1.295,-0.94; 5 1.295,0.94
SOT65P210X110-5N = smd 1.016 x 0.356: 1 -1.016,0.66; 2 -1.016,0; 3 -1.016,-0.66; 4 1.016,-0.66; 5 1.016,0.66
MSOP10 = smd 0.25 x 1: 1 -1,-2.113; 2 -0.5,-2.113; 3 0,-2.113; 4 0.5,-2.113; 5 1,-2.113; 6 1,2.113; 7 0.5,2.113; 8 0,2.113; 9 -0.5,2.113; 10 -1,2.113
FGPMMOPA6H = smd 2 x 1: P$1 -7.5,6.75; P$2 -7.5,5.25; P$3 -7.5,3.75; P$4 -7.5,2.25; P$5 -7.5,0.75; P$6 -7.5,-0.75; P$7 -7.5,-2.25; P$8 -7.5,-3.75; P$9 -7.5,-5.25; P$10 -7.5,-6.75; P$11 7.5,-6.75; P$12 7.5,-5.25; P$13 7.5,-3.75; P$14 7.5,-2.25; P$15 7.5,-0.75; P$16 7.5,0.75; P$17 7.5,2.25; P$18 7.5,3.75; P$19 7.5,5.25; P$20 7.5,6.75 | hole 3: 0.5,0.85
AMPHENOL_901-143 = drill 1.499: 1 0,0 | drill 1.702: 2 -2.54,2.54; 3 -2.54,-2.54; 4 2.54,-2.54; 5 2.54,2.54
MEGA2650_UPSIDEDOWNMOUNT = drill 1.016 pad 1.88: 0 27.94,-20.32; 1 25.4,-20.32; 2 22.86,-20.32; 3 20.32,-20.32; 3.3V 0,27.94; 4 17.78,-20.32; 5 15.24,-20.32; 5V 2.54,27.94; 5V. 58.42,-20.32; 5V.. 60.96,-20.32; 6 12.7,-20.32; 7 10.16,-20.32; 8 6.096,-20.32; 9 3.556,-20.32; 10 1.016,-20.32; 11 -1.524,-20.32; 12 -4.064,-20.32; 13 -6.604,-20.32; 14 33.02,-20.32; 15 35.56,-20.32; 16 38.1,-20.32; 17 40.64,-20.32; 18 43.18,-20.32; 19 45.72,-20.32; 20 48.26,-20.32; 21 50.8,-20.32; A0 15.24,27.94; A1 17.78,27.94; A2 20.32,27.94; A3 22.86,27.94; A4 25.4,27.94; A5 27.94,27.94; A6 30.48,27.94; A7 33.02,27.94; A8 38.1,27.94; A9 40.64,27.94; A10 43.18,27.94; A11 45.72,27.94; A12 48.26,27.94; A13 50.8,27.94; A14 53.34,27.94; A15 55.88,27.94; AREF -11.684,-20.32; GND -9.144,-20.32; GND. 7.62,27.94; GND.. 5.08,27.94; GND... 58.42,22.86; GND.... 60.96,22.86; I/OREF -5.08,27.94; N/C -7.62,27.94; RESET -2.54,27.94; SCL1 -16.764,-20.32; SDA1 -14.224,-20.32; VIN 10.16,27.94 | drill 1.016 pad 1.88 octagon: 22 58.42,-17.78; 23 60.96,-17.78; 24 58.42,-15.24; 25 60.96,-15.24; 26 58.42,-12.7; 27 60.96,-12.7; 28 58.42,-10.16; 29 60.96,-10.16; 30 58.42,-7.62; 31 60.96,-7.62; 32 58.42,-5.08; 33 60.96,-5.08; 34 58.42,-2.54; 35 60.96,-2.54; 36 58.42,0; 37 60.96,0; 38 58.42,2.54; 39 60.96,2.54; 40 58.42,5.08; 41 60.96,5.08; 42 58.42,7.62; 43 60.96,7.62; 44 58.42,10.16; 45 60.96,10.16; 46 58.42,12.7; 47 60.96,12.7; 48 58.42,15.24; 49 60.96,15.24; 50 58.42,17.78; 51 60.96,17.78; 52 58.42,20.32; 53 60.96,20.32; +5V_ 30.48,0; GND__ 30.48,5.08; MISO 27.94,0; MOSI 30.48,2.54; RESET. 27.94,5.08; SCK 27.94,2.54 | smd 1.016 x 0.508: <PWR>+V -31.75,21.59; <PWR>-V -31.75,24.13; <USB>+V -33.02,-10.16; <USB>D+ -33.02,-8.89; <USB>D- -33.02,-6.35; <USB>GND -33.02,-5.08
ROCKBLOCK_MK2_UPSIDEDOWN = drill 1.016 pad 1.88 octagon: 1 49,40.25; 2 49,37.71; 3 49,35.17; 4 49,32.63; 5 49,30.09; 6 49,27.55; 7 49,23.38; 8 49,20.84; 9 49,18.3; 10 49,15.76; 11 49,13.22; 12 49,10.68; 13 49,8.14; 14 49,5.6 | hole 2.2: 48.9,2.5; 7,72.2
SOIC127P600X175-16N = smd 1.981 x 0.508: 1 -2.464,4.445; 2 -2.464,3.175; 3 -2.464,1.905; 4 -2.464,0.635; 5 -2.464,-0.635; 6 -2.464,-1.905; 7 -2.464,-3.175; 8 -2.464,-4.445; 9 2.464,-4.445; 10 2.464,-3.175; 11 2.464,-1.905; 12 2.464,-0.635; 13 2.464,0.635; 14 2.464,1.905; 15 2.464,3.175; 16 2.464,4.445
MICRO-SD-SOCKET-PP = smd 0.8 x 1.5: 1 -8.94,10.7; 2 -7.84,10.3; 3 -6.74,10.7; 4 -5.64,10.9; 5 -4.54,10.7; 6 -3.44,10.9; 7 -2.34,10.7; 8 -1.24,10.7 | smd 1.8 x 1.4: CD1 -2.05,0.4; CD2 -7.75,0.4 | smd 1.4 x 1.9: GND1 -13.6,14.55; GND3 -0.45,13.55
LGA14 = smd 1.15 x 0.55: P$1 -1.1,2; P$2 -1.1,1.2; P$3 -1.1,0.4; P$4 -1.1,-0.4; P$5 -1.1,-1.2; P$6 -1.1,-2; P$8 1.1,-2; P$9 1.1,-1.2; P$10 1.1,-0.4; P$11 1.1,0.4; P$12 1.1,1.2; P$13 1.1,2 | smd 0.55 x 1.15: P$7 0,-2.1; P$14 0,2.1
SOT23-DBV = smd 0.55 x 1.2: 1 -0.95,-1.3; 2 0,-1.3; 3 0.95,-1.3; 4 0.95,1.3; 5 -0.95,1.3
DS3234 = smd 0.53 x 1.98: 1 -5.715,-4.685; 2 -4.445,-4.685; 3 -3.175,-4.685; 4 -1.905,-4.685; 5 -0.635,-4.685; 6 0.635,-4.685; 7 1.905,-4.685; 8 3.175,-4.685; 9 4.445,-4.685; 10 5.715,-4.685; 11 5.715,4.685; 12 4.445,4.685; 13 3.175,4.685; 14 1.905,4.685; 15 0.635,4.685; 16 -0.635,4.685; 17 -1.905,4.685; 18 -3.175,4.685; 19 -4.445,4.685; 20 -5.715,4.685

### Placement (x,y rotation side)
B1  112.52,93.09 0 top
B2  93.66,10.41 180 top
C1  57.28,86.74 180 top
C2  50.8,89.66 270 top
C3  55.5,98.04 0 top
C4  39.88,89.66 270 top
C5  41.53,97.54 180 top
C6  96.77,78.23 270 top
C7  88.01,79.12 270 top
C8  89.28,90.81 180 top
C9  100.46,90.93 90 top
C10  127.76,81.03 0 top
C11  127.64,98.93 180 top
C12  132.59,77.85 270 top
C13  118.36,29.97 0 top
C14  84.2,35.31 90 top
C15  82.36,7.05 0 top
C16  100.71,18.16 270 top
C17  56.26,5.71 270 top
C18  132.84,3.81 0 top
C19  138.05,13.84 0 top
C20  152.91,14.73 0 top
C21  149.48,18.8 270 top
C22  133.1,6.54 180 top
C23  120.21,7.3 0 top
D1  48.13,98.55 270 top
D2  126.87,11.3 0 top
D3  132.84,13.46 0 top
IC1  145.86,7.49 270 top
JP1  68.58,97.54 0 top
JP2  68.58,92.96 0 top
JP4  156.08,7.87 0 top
Q1  68.33,82.17 180 top
Q2  72.52,82.17 180 top
R1  47.37,90.55 0 top
R2  43.56,89.66 90 top
R3  41.53,99.69 180 top
R4  79.76,83.44 270 top
R5  76.2,82.68 270 top
R6  61.34,83.31 90 top
R7  64.52,82.42 90 top
R8  79.5,77.85 270 top
R9  76.2,77.47 270 top
R10  61.34,77.85 270 top
R11  64.64,77.47 270 top
R12  96.9,85.72 180 top
R13  94.61,99.06 270 top
R15  99.44,99.06 270 top
R16  97.03,99.06 90 top
R17  107.31,76.71 90 top
R18  114.05,66.8 270 top
R19  110.24,76.71 270 top
R20  116.97,66.8 90 top
R21  118.75,78.61 180 top
R22  115.19,78.61 180 top
R23  69.47,39.88 270 top
R24  73.28,39.12 0 top
R25  53.98,19.56 270 top
R26  133.1,9.21 180 top
R27  131.83,17.02 270 top
R28  122.43,15.49 180 top
T1  109.09,80.52 90 top
T2  115.19,63.12 270 top
T3  118.87,83.19 0 top
T4  70.74,33.4 270 top
TP1  151.38,77.72 180 top
TP2  156.21,77.6 0 top
TP3  135.57,17.4 180 top
TP4  158.24,15.24 180 top
TP5  46.48,5.97 0 top
TP6  67.31,87.63 0 top
TP7  71.63,87.63 0 top
TP8  34.42,90.17 0 top
TP9  146.43,77.72 0 top
TP10  141.1,77.72 0 top
TP11  55.63,78.99 0 top
TP12  158.24,42.42 90 top
TP13  158.37,36.58 90 top
TP14  145.86,14.8 270 top
TP15  158.88,93.6 90 top
TP16  158.24,49.28 90 top
TP17  84.84,89.03 0 top
TP18  61.85,16.76 180 top
TP19  62.48,11.3 180 top
TP20  86.55,18.03 0 top
TP21  68.33,77.34 0 top
TP22  72.52,77.34 0 top
TP23  57.4,16.76 0 top
TP24  145.92,18.8 270 top
TR1  96.9,95.76 0 top
U1  56.13,91.19 180 top
U2  59.05,96.77 90 top
U3  41.53,93.73 0 top
U4  89.92,84.96 90 top
U5  99.69,78.11 90 top
U6  90.17,94.61 270 top
U7  96.9,90.17 0 top
U8  126.24,84.07 270 top
U9  138.81,92.2 0 top
U10  152.53,85.85 0 top
U11  135.89,77.6 90 top
U12  120.02,51.69 180 top
U13  0.25,11.43 0 top
U14  104.14,17.91 90 top
U15  90.68,36.96 90 top
U16  65.53,19.3 180 top
U17  57.4,10.29 0 top
U18  153.03,18.41 0 top
U19  122.3,12.19 0 top
U20  112.08,9.27 90 top

### Tracks (layer width: path | path; a pad name or v marks a point on that pad's centre or on a via)
3V3SP_ON
  Top 0.406: U12.8 113.92,67.78 R18.1
5VSP_ON
  Top 0.406: U12.6 R17.1
+3V3  (via drill 0.6)  (1 unrouted)
  Top 0.406: U18.5 149.55,19.71 C21.1 146.77,19.65 TP24.1 | U15.1 84.24,34.49 | 84.24,34.49 C14.1 v84.2,32.38 84.24,32.42 84.24,34.49 | U20.4 119.29,7.37 C23.1 119.36,2.18 v119.38,2.16 | U16.4 71.25,8.33 71.25,7.49 71.69,7.05 C15.1 81.51,4.85 v81.53,4.83 | v53.85,6.48 56.17,6.48 C17.1 56.3,6.61 U17.P$6 56.3,8.17 56.26,8.13 56.26,8.26 | U17.P$1 53.88,12.29 v53.85,12.32 | U11.5 132.68,78.61 C12.1 | v120.52,85.85 120.44,85.85 T3.3 | T2.3 139.45,63.12 v139.7,62.87
  Bottom 0.406: 82.17,2.16 v119.38,2.16 127.89,2.16 144.53,18.8 TP24.1 139.7,25.02 | 82.17,2.16 56.01,2.16 53.85,4.32 v53.85,6.48 v53.85,12.32 | v81.53,4.83 81.53,2.79 82.17,2.16 | 139.7,25.02 132.33,32.38 v84.2,32.38 132.46,32.38 139.7,25.15 | 139.7,25.15 139.7,25.02 | 139.7,25.15 139.7,62.36 v139.7,62.87 139.7,72.39 132.59,79.5 v132.59,80.9 125.48,80.9 v120.52,85.85
+3V3SP  (via drill 0.6)
  Top 0.254: C9.1 100.24,90.3 99.19,90.3 98.3,91.19 96.9,91.19 U7.8
  Top 0.406: T2.2 112.78,62.17 | 112.78,62.17 97.47,62.17 89.79,69.85 89.79,73.03 87.88,74.93 82.55,74.93 81.53,75.95 81.53,80.39 R4.2 79.41,81.83 R5.2 74.91,81.83 Q2.1 | R7.2 63.21,84.58 R6.2 | Q1.1 69.28,85.02 v69.34,85.09 | C9.1 102.32,90.08 109.09,83.31 111.51,83.31 112.78,82.04 112.78,73.79 112.27,73.28 112.27,62.68 112.78,62.17
  Bottom 0.406: 61.85,85.09 68.83,85.09 v69.34,85.09 70.23,85.09 72.14,83.19 72.14,82.17 R4.2 | 61.85,85.09 R6.2 | 61.85,85.09 63.5,86.74 JP2.1 JP1.1
+5V  (via drill 0.6)  (1 unrouted)
  Top 0.406: U8.5 126.91,83.04 C10.1 126.91,78.32 v127.13,78.11 | U18.1 152.06,17.09 C20.1 145.92,14.73 TP14.1 144.91,13.84 C19.+ | C19.+ 139.42,12.33 IC1.1 IC1.2 | C19.+ 139.42,19.96 137.67,21.72 118.87,21.72 117.47,23.11 U12.5V 117.47,29.93 C13.1 117.47,30.01 v117.47,34.67 | U14.5 102.23,18.92 | 102.23,18.92 100.8,18.92 C16.1 | v101.98,20.32 101.98,19.18 102.23,18.92 | v75.18,33.4 T4.3 | v105.54,80.52 T1.3
  Bottom 0.406: v101.98,20.32 104.65,17.65 116.97,17.65 117.47,18.16 U12.5V 117.47,24.26 111,30.73 77.85,30.73 v75.18,33.4 | v117.47,34.67 117.47,52.2 111.76,57.91 111.76,73.53 | 111.76,73.53 110.87,74.42 110.87,75.18 v105.54,80.52 | 111.76,73.53 114.43,76.2 126.24,76.2 127.13,77.09 v127.13,78.11
+5V_SP  (via drill 0.6)
  Top 0.406: U1.2 60.2,90.55 60.71,90.04 60.71,86.49 59.82,85.6 59.82,78.11 R10.2 64.6,76.58 R11.2 | R9.2 79.46,76.62 R8.2 | U4.2 89.28,81.03 91.31,78.99 92.2,78.99 | 92.2,78.99 96.69,78.99 C6.1 99,79.08 U5.5 | T1.2 109.36,82.3 104.9,82.3 103.5,80.9 v103.5,76.83 | v92.2,75.06 92.2,78.99
  Bottom 0.406: R10.2 63.5,74.42 78.49,74.42 79.5,75.44 R8.2 81.03,75.06 v92.2,75.06 101.73,75.06 v103.5,76.83
ACCEL3V3  (via drill 0.6)
  Top 0.254: v61.85,6.35 58.29,6.35 57.4,7.24 U17.P$7
  Top 0.406: U15.2 87.5,32.51 v83.57,28.57
  Bottom 0.406: v83.57,28.57 83.57,22.1 82.93,21.46 79.38,21.46 69.72,11.81 67.31,11.81 v61.85,6.35
ACCEL5V
  Top 0.406: U15.3 88.77,32.26 81.92,25.4 U12.A8
GND  (via drill 0.6)  (1 unrouted)
  Top 0.254: R16.1 98.21,98.21 98.3,98.3 98.3,99.95 102.62,99.95 102.74,99.82 | U7.3 96.9,89.41 98.68,89.41 102.23,85.85 102.74,85.85 v102.74,84.58
  Top 0.406: C9.2 100.5,91.82 101.98,91.82
  other vias: 63.88,14.35 114.94,84.71 146.05,81.79 141.35,19.05 127.89,15.88 93.34,19.43 59.31,4.57 63.63,19.81 84.96,4.95 53.47,86.49 104.27,97.16 83.82,98.81
  pour Top (isolate 0.305): -1.27,102.49 92.33,102.49 92.33,93.22 101.98,93.22 101.98,102.49 163.83,102.49 163.83,-1.27 -1.27,-1.27
  pour Bottom (isolate 0.305): -1.27,102.49 92.33,102.74 92.33,93.22 101.98,93.22 101.98,102.49 163.83,102.49 163.83,-1.27 -1.27,-1.27
  pour Top: 93.09,93.98 101.09,93.98 101.09,102.11 93.09,102.11
GPSON
  Top 0.406: 119.63,78.57 R21.1 119.51,78.53 119.51,77.34 116.46,74.3 U12.9
GPSRX3V3
  Top 0.406: U9.P$10 135.48,81.28 136.02,80.64 136.55,80.11 U11.4 140.21,78.61 TP10.1
GPSRX5V
  Top 0.254: U11.2 135.89,75.06 136.02,74.93
  Top 0.406: TP1.1 151.38,76.45 149.86,74.93 136.02,74.93 | U12.12 124.08,72.64 126.49,75.06 135.89,75.06
GPSTX3V3
  Top 0.254: U8.2 126.24,86.23 127,87 131.27,87 U9.P$9
  Top 0.406: U9.P$9 133.65,86.95 137.29,83.31 140.34,83.31 144.78,78.87 145.29,78.87 TP9.1
GPSTX5V
  Top 0.406: U8.4 125.58,77.24 124.88,76.54 124.54,76.2 121.54,73.2 U12.11 121.54,70.87 122.17,70.23 139.06,70.23 141.86,73.03 153.8,73.03 156.21,75.44 TP2.1
MISO  (via drill 0.6)
  Top 0.406: U14.4 106.17,18.92 106.93,19.68 106.93,30.86 v102.36,35.43 | TP12.1 109.6,42.42 100.33,51.69 U12.MISO
  Bottom 0.406: v102.36,35.43 102.36,44.83 95.5,51.69 U12.MISO
MISO3V3  (via drill 0.6)
  Top 0.406: U17.P$12 62.3,11.49 TP19.1 66.42,11.3 67.82,9.91 67.82,8.66 U16.7 67.87,5.15 v68.33,4.7 | v103.76,4.83 U20.19 | U14.2 v104.14,14.35
  Bottom 0.406: v68.33,4.7 73.66,4.7 77.72,8.76 86.11,8.76 90.04,4.83 v103.76,4.83 103.76,5.46 104.65,6.35 104.65,13.84 104.33,14.16 v104.14,14.35
MOSI
  Top 0.406: U12.MOSI 88.27,49.15 | 88.27,49.15 87.38,48.26 87.38,46.23 88.9,44.7 91.69,44.7 92.58,43.81 U15.11 | TP16.1 106.05,49.28 99.19,56.13 89.03,56.13 87,54.1 87,50.42 88.27,49.15
MOSI3V3  (via drill 0.6)
  Top 0.406: U17.P$13 58.5,13.42 TP18.1 | TP18.1 66.67,16.76 72.26,11.18 72.26,8.61 U16.3 72.27,11.44 73.66,12.83 v81.03,12.83 | U15.12 91.31,41.4 90.55,42.16 85.85,42.16 80.01,36.32 80.01,28.83 77.85,26.67 64.52,26.67 61.85,24 TP18.1 | 61.72,16.89 TP18.1 | v102.36,7.37 U20.17
  Bottom 0.406: v81.03,12.83 85.09,12.83 90.55,7.37 v102.36,7.37 | 61.72,16.89 TP18.1
N$1
  Top 0.406: D2.A 123.65,11.3 U19.4
N$2
  Top 0.406: T4.1 69.47,34.52 R23.2 69.56,39.12 R24.1
N$3  (via drill 0.6)
  Top 0.406: R28.1 123.6,15.18 U19.5 123.6,13.49 v125.48,15.37 | B2.+$2 85.46,13.33 88.39,16.26 | 88.39,16.26 89.66,17.53 97.54,17.53 101.85,13.21 101.85,10.17 B2.+$1 102.12,10.16 104.01,10.16 105.54,8.64 U20.16 | TP20.1 86.61,18.03 88.39,16.26
  Bottom 0.406: v125.48,15.37 125.48,15.88 124.84,16.51 88.08,16.51 TP20.1
N$4
  Top 0.406: R25.2 52.92,18.71 49.52,22.11 U13.12
N$5
  Top 0.406: C7.1 U4.1
N$6
  Top 0.406: U12.47 57.91,38.99 57.02,38.1 57.02,20.57 56.77,20.32 54.06,20.32 R25.1
N$7
  Top 0.254: TR1.1 95.63,94.23 96.39,93.47 U7.9
N$8
  Top 0.406: U12.44 68.67,41.53 R23.1
N$9  (via drill 0.6)
  Top 0.406: T4.2 68.52,32.45 v66.93,30.86
  Bottom 0.406: v66.93,30.86 66.8,30.86 62.1,26.16 58.17,26.16 52.07,32.26 49.27,32.26 U13.8
N$10
  Top 0.406: U9.P$11 146.33,85.47 148.08,85.47 148.46,85.85 U10.1
N$11
  Top 0.254: U7.10 95.3,92.28 94.87,92.71 | 94.87,92.71 94.11,93.47 94.11,94.74 | 94.11,94.74 94.11,97.7 R13.2 | U6.5 90.17,94.61 93.98,94.61 94.11,94.74 | 93.6,91.69 94.61,92.71 94.87,92.71
  Top 0.406: U6.5 90.17,90.84 C8.1 90.17,90.77 90.17,90.04 89.28,89.15 | U4.7 89.28,89.15 | 89.28,89.15 84.96,89.15 TP17.1 | U4.6 90.55,88.65 93.6,91.69
N$12  (via drill 0.6)
  Top 0.254: U7.6 98.12,92.28 99.69,93.85 v99.69,93.98 99.69,94.36 99.69,97.96 R15.2 | U6.6 92.43,93.32 v92.46,93.34
  Bottom 0.254: v92.46,93.34 99.06,93.34 v99.69,93.98
N$13
  Top 0.254: U7.7 97.4,93.34 98.17,94.11 TR1.2
N$14
  Top 0.406: B1.+$1 104.39,93.02 104.39,90.42 108.2,86.61 117.22,86.61 120.72,90.11 B1.+$2 121.74,92.08 127.64,92.08 130.01,94.45 U9.P$4
N$15
  Top 0.406: R22.1 R21.2 117.89,82.06 T3.1
N$16
  Top 0.254: R16.2 R13.1 94.07,99.91 91.06,96.9 91.06,95.96 U6.1
N$17
  Top 0.406: R28.2 120.27,15.49 119.13,14.35 119.13,11.94 | 119.13,11.94 119.13,9.53 118.24,8.64 U20.5 | U19.2 119.38,12.19 119.13,11.94
N$18  (via drill 0.6)
  Top 0.406: v53.21,24.51 53.21,44.7 51.31,46.61 49.26,46.61 U13.3
  Bottom 0.406: U12.A14 66.67,22.86 65.41,21.59 56.13,21.59 v53.21,24.51
N$19  (via drill 0.6)
  Top 0.406: T3.2 120.82,82.08 122.94,84.2 122.94,88.01 v123.95,89.03 | v128.78,96.77 128.78,98.64 C11.1 128.5,98.95 U9.P$1
  Bottom 0.406: v123.95,89.03 125.98,89.03 129.03,92.08 129.03,96.52 v128.78,96.77
N$20  (via drill 0.6)
  Top 0.406: v55.5,25.4 55.5,45.85 52.2,49.15 49.26,49.15 U13.2
  Bottom 0.406: U12.A15 57.15,23.75 v55.5,25.4
N$21
  Top 0.254: U7.4 97.4,87.13 98.17,86.36 98.17,85.88 R12.1
N$22
  Top 0.254: U7.2 96.4,87.13 95.63,86.36 95.63,85.88 R12.2
N$23
  Top 0.406: 48.26,90.51 C2.1 50.84,90.55 U1.7 U1.6 52.07,91.82 51.44,92.46 51.44,97.28 54.36,100.2 58.29,100.2 59.05,99.44 U2.5 | U3.5 46.05,94.67 48.13,92.58 48.13,90.64 R1.2 48.26,90.51 | TP8.1 34.54,90.17 38.1,86.61 46.48,86.61 48.26,88.39 48.26,90.51
N$24
  Top 0.406: U1.1 58.6,87.72 C1.1
N$25  (via drill 0.6)
  Top 0.406: U3.1 40.23,96.01 | 40.23,96.01 40.23,97.09 C5.2 R3.2 | U2.1 55.65,95.48 v55.63,95.5 | v47.62,95.89 40.36,95.89 40.23,96.01
  Bottom 0.406: v55.63,95.5 48.01,95.5 v47.62,95.89
N$26
  Top 0.406: C3.2 58.09,98.04 U2.6
N$28
  Top 0.406: R1.1 43.6,90.55 R2.2 C4.1 39.88,92.43 U3.3
N$29
  pour Bottom: 93.09,101.47 93.09,93.98 101.09,93.98 101.09,101.47
N$30  (via drill 0.6)
  Top 0.406: U3.4 44.78,92.79 v44.83,92.84 | R3.1 C5.1 45.85,97.54 D1.K
  Bottom 0.406: v44.83,92.84 44.83,96.52 D1.K
N$31
  Top 0.406: IC1.4 134.69,5.79 C22.1 R26.1 133.95,11.43 | 133.95,11.43 133.95,13.36 D3.C 133.84,15.67 TP3.1 | D2.C 133.82,11.3 133.95,11.43
N$32
  Top 0.406: R17.2 R19.1 110.24,79.53 T1.1
N$33
  Top 0.406: R20.1 R18.2 114.05,64.11 T2.1
N$44
  Top 0.406: D3.A 131.84,16.15 R27.2
RTC3V3  (via drill 0.6)
  Top 0.406: v93.85,28.19 92.58,29.46 U15.6 | U20.1 114.94,3.56 114.43,4.06 114.43,18.41 v111.89,20.95
  Bottom 0.406: v93.85,28.19 96.27,25.78 105.28,25.78 106.68,24.38 106.68,21.59 107.31,20.95 v111.89,20.95
RTC5V
  Top 0.406: U12.A2 99.69,26.67 93.85,32.51 U15.7
SCK  (via drill 0.6)
  Top 0.406: v97.16,39.37 95.17,39.37 U15.9 | TP13.1 112.39,36.58 99.82,49.15 U12.SCK
  Bottom 0.406: U12.SCK 94.23,49.15 97.03,46.35 97.03,39.5 v97.16,39.37
SCK3V3
  Top 0.406: U16.5 70.07,2.95 | 70.07,2.95 70.1,2.92 106.76,2.92 U20.20 109.09,3.56 109.47,3.94 109.47,5.71 109.09,6.1 U20.18 111,6.1 112.52,7.62 112.52,17.78 108.2,22.1 108.2,32.51 98.93,41.78 94.61,41.78 93.85,41.02 U15.10 | 70.07,2.95 53.94,2.95 52.32,4.57 52.32,12.95 54.36,14.99 56.01,14.99 | 56.01,14.99 57.4,13.59 U17.P$14 | TP23.1 57.4,16.38 56.01,14.99
SCL3V3
  Top 0.406: TP6.1 67.31,83.33 Q1.2 65.68,81.57 R7.1 61.81,81.57 R6.1 | U6.3 86.51,95.91 85.98,95.38 69.98,95.38 68.58,93.98 | 68.58,93.98 JP2.3 | U2.3 61.87,95.48 62.1,95.25 67.31,95.25 68.58,93.98
  Bottom 0.406: TP6.1 68.58,88.9 JP2.3 JP1.3
SCL5V
  Top 0.406: U12.21 68.33,72.9 TP21.1 | TP21.1 67.35,78.32 R11.1 63.84,79.12 R10.1 | Q1.3 TP21.1
SDA3V3
  Top 0.406: Q2.2 71.63,83.33 71.63,84.58 | 71.63,84.58 TP7.1 74.55,90.55 74.8,90.55 77.57,93.32 U6.4 | R4.1 78.57,83.53 R5.1 76.2,84.45 75.56,85.09 72.14,85.09 71.63,84.58 | U2.4 59.99,98.48 61.72,100.2 69.47,100.2 71.12,98.55 JP1.4
  Bottom 0.406: TP7.1 71.12,88.14 JP2.4 JP1.4
SDA5V
  Top 0.406: U12.20 72.52,72.77 TP22.1 | TP22.1 73.49,78.32 R9.1 77,79.12 R8.1 | Q2.3 TP22.1
SDCARD3V3
  Top 0.406: U16.2 73.37,10.51 73.66,10.79 81.53,10.79 82.8,12.06 82.8,18.8 84.84,20.83 84.84,26.16 90.04,31.37 U15.4
SDCARD5V
  Top 0.406: U12.A5 92.08,25.02 91.31,25.78 U15.5
SHTDN  (via drill 0.6)
  Top 0.406: v115.82,19.3 130.39,19.3 R27.1
  Bottom 0.406: U12.A0 104.78,21.72 107.19,19.3 v115.82,19.3
TEMP3V3  (1 unrouted)
  Top 0.254: U7.1 94.92,88.06 93.73,86.87 93.73,84.45 96.01,82.17 100.33,82.17 | U7.5 98.51,88.06 100.33,86.23 100.33,80.67 100.36,80.64
  Top 0.406: U5.4 100.36,80.64 100.36,82.14
TEMP5V
  Top 0.406: U12.3 U5.2
VBATT
  Top 0.406: TP4.1 154.1,11.1 JP4.1 154.1,4.12 151.51,1.52 140.55,1.52 IC1.5 134.5,4.09 C18.+